# Altium schematic sheet SoC.SchDoc
size A4; SheetNumber: 3; SheetTotal: 3
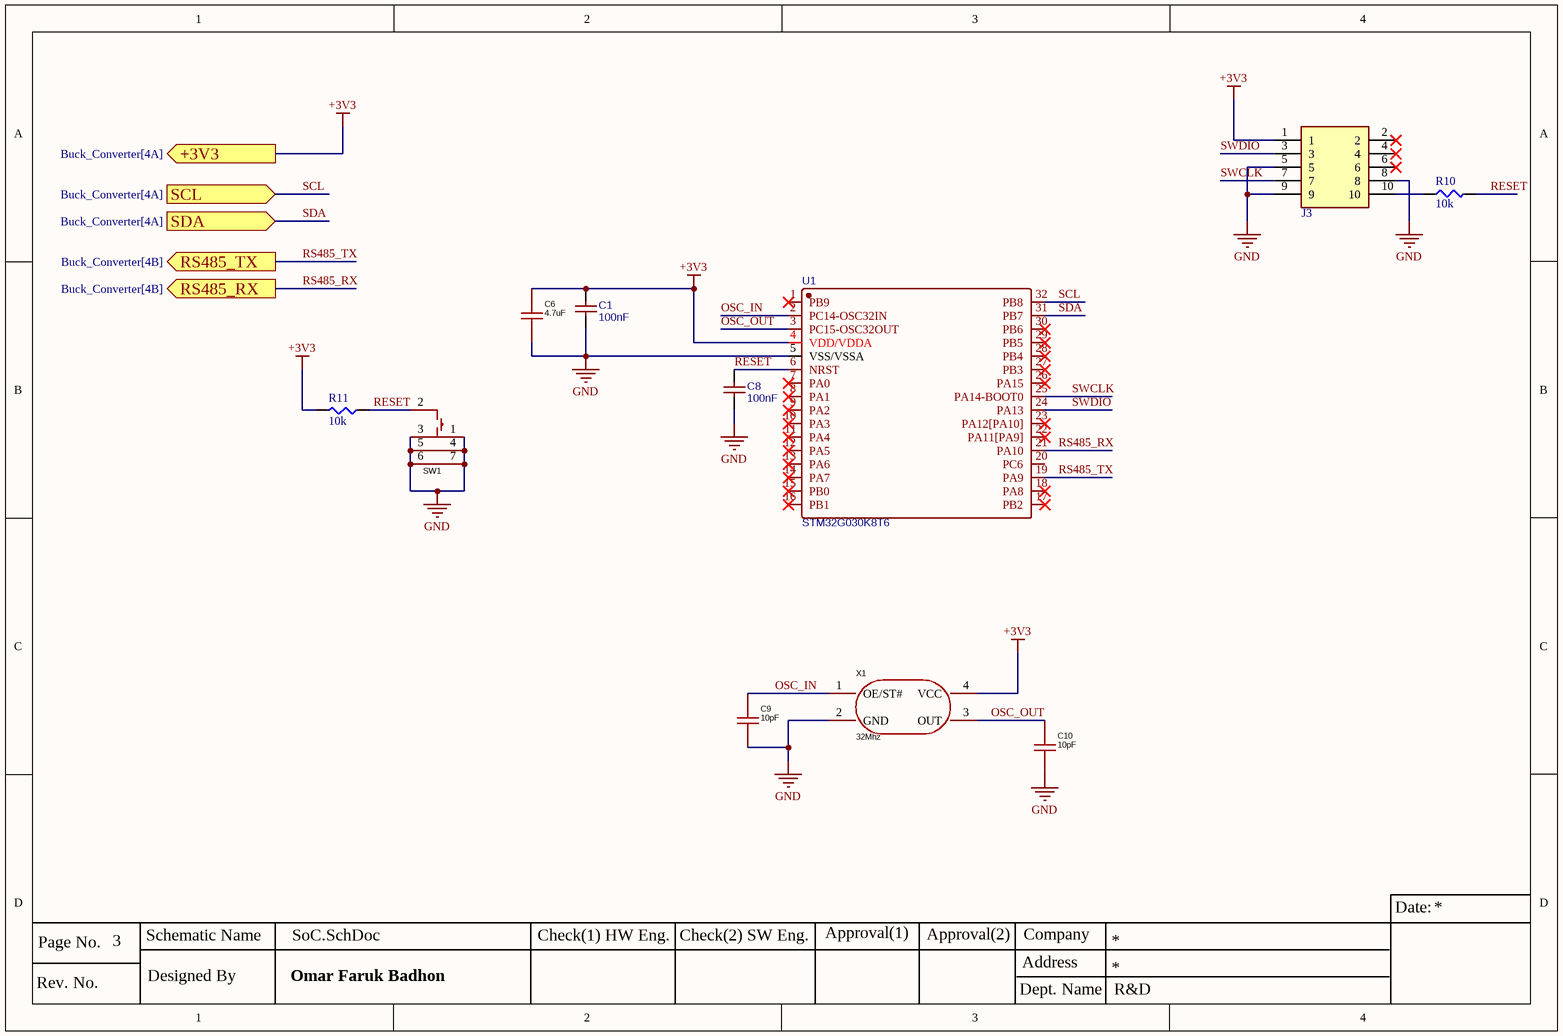
[diagram p0: SoC.SchDoc]

## Parts
C1  100nF  [Cap 100nF 16V]
C6  4.7uF  [Cap 4.7uF]
C8  100nF  [Cap 100nF 16V]
C9  10pF  [Cap 10pF]
C10  10pF  [Cap 10pF]
J3  20021121-00010C4LF  [JTAG]  (value not drawn)
R10  10k  [Res 10K]
R11  10k  [Res 10K]
SW1  TSA020B3418A02  [Push Button]  (value not drawn)
U1  STM32G030K8T6  [STM32G030K8T6]
X1  32Mhz  [Crystal 32MHz]

## Ports
+3V3 (out, see Buck_Converter[4A]), RS485_RX (out, see Buck_Converter[4B]), RS485_TX (out, see Buck_Converter[4B]), SCL (in, see Buck_Converter[4A]), SDA (in, see Buck_Converter[4A])

## Nets
+3V3: C1.2 C6.1 J3.1 R11.2 U1.4(VDD/VDDA) X1.4(VCC) ; port +3V3
GND: C1.1 C6.2 C8.1 C9.1 C10.1 J3.5 J3.8 J3.9 SW1.1 SW1.3 SW1.4 SW1.5 SW1.6 SW1.7 U1.5(VSS/VSSA) X1.2(GND)
OSC_IN: C9.2 U1.2(PC14-OSC32IN) X1.1(OE/ST#)
OSC_OUT: C10.2 U1.3(PC15-OSC32OUT) X1.3(OUT)
RESET: C8.2 R10.2 R11.1 SW1.2 U1.6(NRST)
RS485_RX: U1.21(PA10) ; port RS485_RX
RS485_TX: U1.19(PA9) ; port RS485_TX
SCL: U1.32(PB8) ; port SCL
SDA: U1.31(PB7) ; port SDA
SWCLK: J3.7 U1.25(PA14-BOOT0)
SWDIO: J3.3 U1.24(PA13)
NetJ3_10: J3.10 R10.1

Not connected (* = marked no-connect by the designer): J3 2* 4* 6*; U1 1(PB9)* 7(PA0)* 8(PA1)* 9(PA2)* 10(PA3)* 11(PA4)* 12(PA5)* 13(PA6)* 14(PA7)* 15(PB0)* 16(PB1)* 17(PB2)* 18(PA8)* 20(PC6) 22(PA11[PA9])* 23(PA12[PA10])* 26(PA15)* 27(PB3)* 28(PB4)* 29(PB5)* 30(PB6)*

## Notes on the sheet
- Date:
- Rev. No.
- Page No.
- Schematic Name
- Designed By
- Omar Faruk Badhon
- Check(1) HW Eng.
- Check(2) SW Eng.
- Approval(1)
- Approval(2)
- Address
- Company
- Dept. Name
- R&D

## Library data of the parts
C1 C8 = Cap 100nF: 16V 100nF X7R ±10% 0603 Multilayer Ceramic Capacitors MLCC - SMD/SMT ROHS; Manufacturer: muRata(村田); Manufacturer Part: GRM188R71C104KA01D; nameAlias: Value; Supplier: LCSC; Supplier Part: C45000; JLCPCB Part Class: Extended Part; spicePre: C; spiceSymbolName: GRM188R71C104KA01D
C6 = GRM188C71C475KE21D: 16V 4.7uF X7S ±10% 0603 Multilayer Ceramic Capacitors MLCC - SMD/SMT ROHS; Manufacturer: muRata(村田); Add into BOM: yes; Symbol: GRM188C71C475KE21D; Device: GRM188C71C475KE21D; LCSC Part Name: 4.7uF ±10% 16V; Supplier Part: C237615; Manufacturer Part: GRM188C71C475KE21D; Supplier Footprint: 0603; JLCPCB Part Class: Extended Part; Datasheet: https://atta.szlcsc.com/upload/public/pdf/source/20200305/C490387_23319AE8C154DEB24C505E6C82A8106A.pdf; Supplier: LCSC; Convert to PCB: yes; Value: 4.7uF; Tolerance: ±10%
C9 C10 = Cap 10pF: 25V 10pF NP0 ±5% 0603  Multilayer Ceramic Capacitors MLCC - SMD/SMT ROHS; Manufacturer: YAGEO(国巨); Symbol: CC0603JRNPO8BN100; Add into BOM: yes; Device: CC0603JRNPO8BN100; LCSC Part Name: 10pF ±5% 25V; Supplier Part: C1853175; Manufacturer Part: CC0603JRNPO8BN100; Supplier Footprint: 0603; JLCPCB Part Class: Extended Part; Datasheet: https://atta.szlcsc.com/upload/public/pdf/source/20210519/C1853175_08ABFC5682B471E6C773F36F7C78F8CE.pdf; Supplier: LCSC; Convert to PCB: yes; Value: 10pF; Tolerance: ±5%
J3 = JTAG: Headers & Wire Housings 1.27x1.27mm BTB, Hdr Unshrd, SMT, 10 Pos; Manufacturer_Name: Amphenol; Geometry.Height: 5.7mm; Mouser Part Number: 649-202112100010C4LF; Mouser Price/Stock: https://www.mouser.co.uk/ProductDetail/Amphenol-FCI/20021121-00010C4LF?qs=iIVTEDlrHA1ddfCJGH4Nhg%3D%3D; Manufacturer_Part_Number: 20021121-00010C4LF; Datasheet Link: https://cdn.amphenol-cs.com/media/wysiwyg/files/drawing/20021121.pdf
R10 R11 = ERJ-PA3F1002V_1: RES SMD 10K OHM 1% 1/4W 0603; Manufacturer: Panasonic Electronic Components; Factory Stock: 0; Unit Price (USD): 0.02372; @ qty: 1500; Minimum Quantity: 1; Power (Watts): 0.25W, 1/4W; Temperature Coefficient: ±100ppm/°C; Part Number: ERJ-PA3F1002V; Datasheets: https://industrial.panasonic.com/cdbs/www-data/pdf/RDA0000/AOA0000C243.pdf; Image: //media.digikey.com/Photos/Panasonic%20Photos/MFG_ERJ-P6W%20Series.jpg; Digi-Key Part Number: P10KBYCT-ND; Quantity Available: 12488; Packaging: Cut Tape (CT); Series: ERJ; Part Status: Active; Value: 10k; Tolerance: ±1%; Composition: Thick Film; Features: Automotive AEC-Q200, Pulse Withstanding; Operating Temperature: -55°C ~ 155°C; Package / Case: 0603 (1608 Metric); Supplier Device Package: 0603; Size / Dimension: 0.063" L x 0.031" W (1.60mm x 0.80mm); Height - Seated (Max): 0.022" (0.55mm); Number of Terminations: 2; Failure Rate: -
SW1 = Push Button: Manufacturer: BZCN(博众电气); Add into BOM: yes; Actuator Style: Round Button; Operating Force: 180gf; Switch Length: 4.5mm; Switch Width: 3.4mm; Contact Current: 50mA; Voltage Rating (DC): 12V; Symbol: TSA020B3418A02; Device: TSA020B3418A02; LCSC Part Name: 4.5*3.4*3.4mm 卧贴 轻触开关; Supplier Part: C2888897; Manufacturer Part: TSA020B3418A02; Supplier Footprint: SMD; JLCPCB Part Class: Extended Part; Datasheet: https://atta.szlcsc.com/upload/public/pdf/source/20210826/A0412DE55436A0A9154118D90A036ADB.pdf; Supplier: LCSC; Convert to PCB: yes; Mounting Style: Surface Mount; Switch Height: 3.4mm; Voltage Rating (AC): -; Mechanical Life: -
U1 = STM32G030K8T6: Manufacturer: ST(意法半导体); Contributor: LCSC; Supplier: LCSC; Supplier Part: C431631; Manufacturer Part: STM32G030K8T6; JLCPCB Part Class: Extended Part; spicePre: U; spiceSymbolName: STM32G030K8T6
X1 = Crystal: Manufacturer: EPSON(爱普生); Symbol: X1G004481000900; Device: X1G0044810009; Add into BOM: yes; Supply Voltage: 1.6V~3.6V; Supply Current (Max): 3mA; Frequency Stability(Full temperature range): ±100ppm; LCSC Part Name: X1G0044810009; Supplier Part: C70524; Manufacturer Part: X1G0044810009; Supplier Footprint: SMD7050-4P; JLCPCB Part Class: Extended Part; Datasheet: https://atta.szlcsc.com/upload/public/pdf/source/20161110/1478747518408.pdf; Supplier: LCSC; Convert to PCB: yes; Value: 32MHz; Operating Temperature: -40℃~+85℃